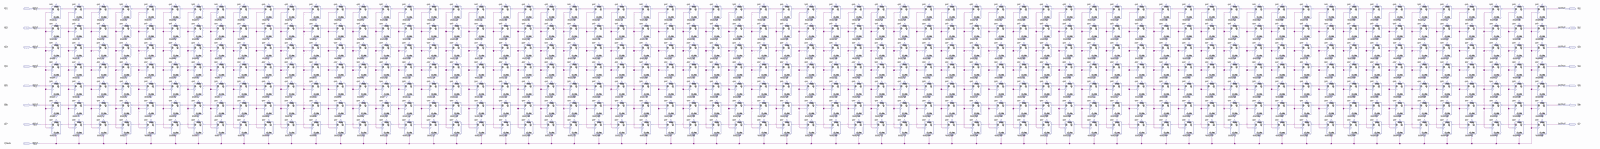
[diagram p0: schematic sheet, whole]
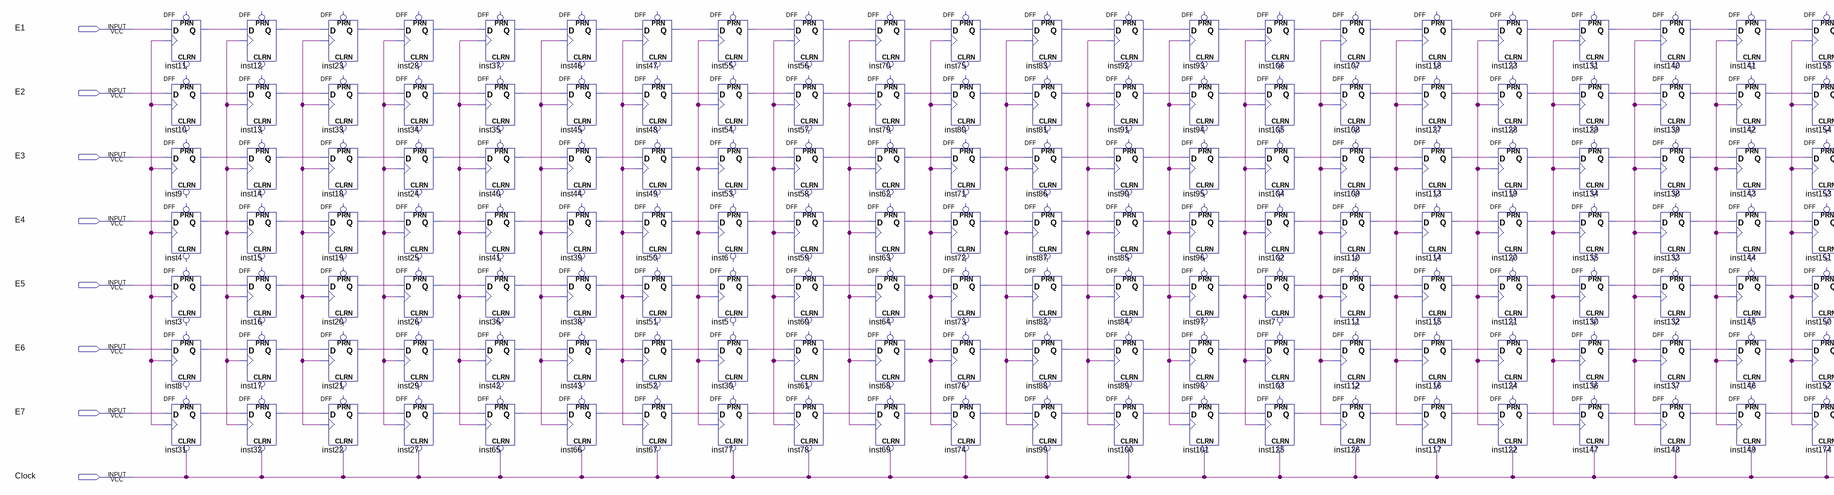
[diagram p1: schematic sheet, left part]
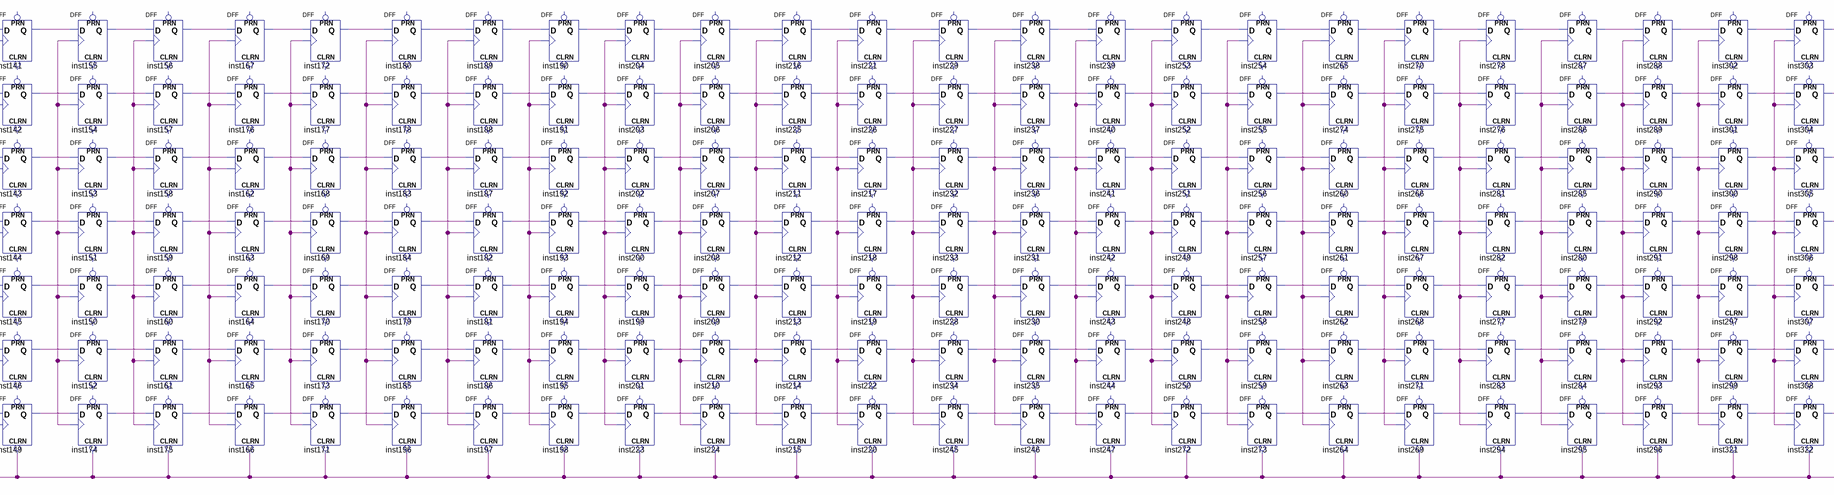
[diagram p2: schematic sheet, centre part]
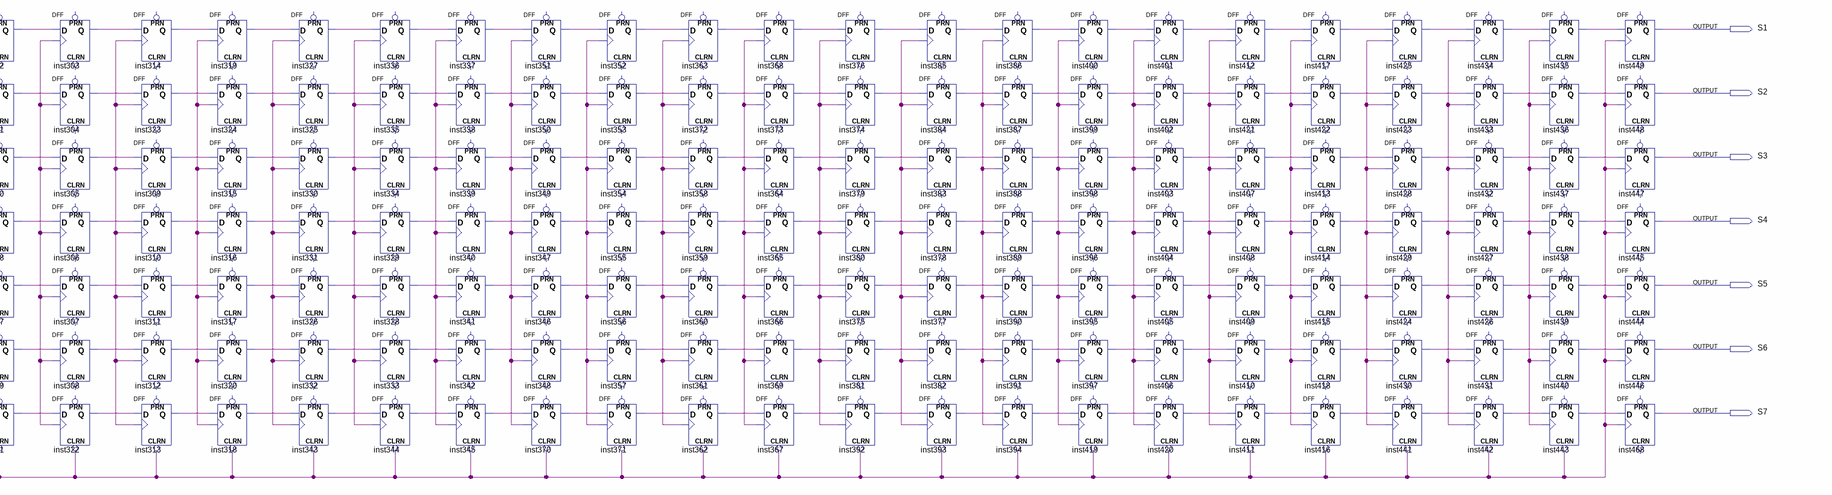
[diagram p3: schematic sheet, right part]
// Quartus schematic Memoria2.bdf as structural Verilog: 448 symbols, 15 pins
module Memoria2 (
  input  E1,
  input  E2,
  input  E3,
  input  E4,
  input  E5,
  input  E6,
  input  E7,
  input  Clock,
  output S1,
  output S2,
  output S3,
  output S4,
  output S5,
  output S6,
  output S7
);

  wire inst3_q, inst4_q, inst5_q, inst6_q, inst7_q, inst8_q, inst9_q, inst10_q, inst11_q, inst12_q, inst13_q,
       inst14_q, inst15_q, inst16_q, inst17_q, inst18_q, inst19_q, inst20_q, inst21_q, inst22_q, inst23_q,
       inst24_q, inst25_q, inst26_q, inst27_q, inst28_q, inst29_q, inst30_q, inst31_q, inst32_q, inst33_q,
       inst34_q, inst35_q, inst36_q, inst37_q, inst38_q, inst39_q, inst40_q, inst41_q, inst42_q, inst43_q,
       inst44_q, inst45_q, inst46_q, inst47_q, inst48_q, inst49_q, inst50_q, inst51_q, inst52_q, inst53_q,
       inst54_q, inst55_q, inst56_q, inst57_q, inst58_q, inst59_q, inst60_q, inst61_q, inst62_q, inst63_q,
       inst64_q, inst65_q, inst66_q, inst67_q, inst68_q, inst69_q, inst70_q, inst71_q, inst72_q, inst73_q,
       inst74_q, inst75_q, inst76_q, inst77_q, inst78_q, inst79_q, inst80_q, inst81_q, inst82_q, inst83_q,
       inst84_q, inst85_q, inst86_q, inst87_q, inst88_q, inst89_q, inst90_q, inst91_q, inst92_q, inst93_q,
       inst94_q, inst95_q, inst96_q, inst97_q, inst98_q, inst99_q, inst100_q, inst101_q, inst102_q,
       inst103_q, inst104_q, inst105_q, inst106_q, inst107_q, inst108_q, inst109_q, inst110_q, inst111_q,
       inst112_q, inst113_q, inst114_q, inst115_q, inst116_q, inst117_q, inst118_q, inst119_q, inst120_q,
       inst121_q, inst122_q, inst123_q, inst124_q, inst125_q, inst126_q, inst127_q, inst128_q, inst129_q,
       inst130_q, inst131_q, inst132_q, inst133_q, inst134_q, inst135_q, inst136_q, inst137_q, inst138_q,
       inst139_q, inst140_q, inst141_q, inst142_q, inst143_q, inst144_q, inst145_q, inst146_q, inst147_q,
       inst148_q, inst149_q, inst150_q, inst151_q, inst152_q, inst153_q, inst154_q, inst155_q, inst156_q,
       inst157_q, inst158_q, inst159_q, inst160_q, inst161_q, inst162_q, inst163_q, inst164_q, inst165_q,
       inst166_q, inst167_q, inst168_q, inst169_q, inst170_q, inst171_q, inst172_q, inst173_q, inst174_q,
       inst175_q, inst176_q, inst177_q, inst178_q, inst179_q, inst180_q, inst181_q, inst182_q, inst183_q,
       inst184_q, inst185_q, inst186_q, inst187_q, inst188_q, inst189_q, inst190_q, inst191_q, inst192_q,
       inst193_q, inst194_q, inst195_q, inst196_q, inst197_q, inst198_q, inst199_q, inst200_q, inst201_q,
       inst202_q, inst203_q, inst204_q, inst205_q, inst206_q, inst207_q, inst208_q, inst209_q, inst210_q,
       inst211_q, inst212_q, inst213_q, inst214_q, inst215_q, inst216_q, inst217_q, inst218_q, inst219_q,
       inst220_q, inst221_q, inst222_q, inst223_q, inst224_q, inst225_q, inst226_q, inst227_q, inst228_q,
       inst229_q, inst230_q, inst231_q, inst232_q, inst233_q, inst234_q, inst235_q, inst236_q, inst237_q,
       inst238_q, inst239_q, inst240_q, inst241_q, inst242_q, inst243_q, inst244_q, inst245_q, inst246_q,
       inst247_q, inst248_q, inst249_q, inst250_q, inst251_q, inst252_q, inst253_q, inst254_q, inst255_q,
       inst256_q, inst257_q, inst258_q, inst259_q, inst260_q, inst261_q, inst262_q, inst263_q, inst264_q,
       inst265_q, inst266_q, inst267_q, inst268_q, inst269_q, inst270_q, inst271_q, inst272_q, inst273_q,
       inst274_q, inst275_q, inst276_q, inst277_q, inst278_q, inst279_q, inst280_q, inst281_q, inst282_q,
       inst283_q, inst284_q, inst285_q, inst286_q, inst287_q, inst288_q, inst289_q, inst290_q, inst291_q,
       inst292_q, inst293_q, inst294_q, inst295_q, inst296_q, inst297_q, inst298_q, inst299_q, inst300_q,
       inst301_q, inst302_q, inst303_q, inst304_q, inst305_q, inst306_q, inst307_q, inst308_q, inst309_q,
       inst310_q, inst311_q, inst312_q, inst313_q, inst314_q, inst315_q, inst316_q, inst317_q, inst318_q,
       inst319_q, inst320_q, inst321_q, inst322_q, inst323_q, inst324_q, inst325_q, inst326_q, inst327_q,
       inst328_q, inst329_q, inst330_q, inst331_q, inst332_q, inst333_q, inst334_q, inst335_q, inst336_q,
       inst337_q, inst338_q, inst339_q, inst340_q, inst341_q, inst342_q, inst343_q, inst344_q, inst345_q,
       inst346_q, inst347_q, inst348_q, inst349_q, inst350_q, inst351_q, inst352_q, inst353_q, inst354_q,
       inst355_q, inst356_q, inst357_q, inst358_q, inst359_q, inst360_q, inst361_q, inst362_q, inst363_q,
       inst364_q, inst365_q, inst366_q, inst367_q, inst368_q, inst369_q, inst370_q, inst371_q, inst372_q,
       inst373_q, inst374_q, inst375_q, inst376_q, inst377_q, inst378_q, inst379_q, inst380_q, inst381_q,
       inst382_q, inst383_q, inst384_q, inst385_q, inst386_q, inst387_q, inst388_q, inst389_q, inst390_q,
       inst391_q, inst392_q, inst393_q, inst394_q, inst395_q, inst396_q, inst397_q, inst398_q, inst399_q,
       inst400_q, inst401_q, inst402_q, inst403_q, inst404_q, inst405_q, inst406_q, inst407_q, inst408_q,
       inst409_q, inst410_q, inst411_q, inst412_q, inst413_q, inst414_q, inst415_q, inst416_q, inst417_q,
       inst418_q, inst419_q, inst420_q, inst421_q, inst422_q, inst423_q, inst424_q, inst425_q, inst426_q,
       inst427_q, inst428_q, inst429_q, inst430_q, inst431_q, inst432_q, inst433_q, inst434_q, inst435_q,
       inst436_q, inst437_q, inst438_q, inst439_q, inst440_q, inst441_q, inst442_q, inst443_q, undriven,
       undriven_2, undriven_3, undriven_4, undriven_5, undriven_6, undriven_7, undriven_8, undriven_9,
       undriven_10, undriven_11, undriven_12, undriven_13, undriven_14, undriven_15, undriven_16,
       undriven_17, undriven_18, undriven_19, undriven_20, undriven_21, undriven_22, undriven_23,
       undriven_24, undriven_25, undriven_26, undriven_27, undriven_28, undriven_29, undriven_30,
       undriven_31, undriven_32, undriven_33, undriven_34, undriven_35, undriven_36, undriven_37,
       undriven_38, undriven_39, undriven_40, undriven_41, undriven_42, undriven_43, undriven_44,
       undriven_45, undriven_46, undriven_47, undriven_48, undriven_49, undriven_50, undriven_51,
       undriven_52, undriven_53, undriven_54, undriven_55, undriven_56, undriven_57, undriven_58,
       undriven_59, undriven_60, undriven_61, undriven_62, undriven_63;

  DFF inst11 (.CLK(undriven_2), .D(E1), .Q(inst11_q));  // open: CLRN, PRN
  DFF inst10 (.CLK(undriven_2), .D(E2), .Q(inst10_q));  // open: CLRN, PRN
  DFF inst9 (.CLK(undriven_2), .D(E3), .Q(inst9_q));  // open: CLRN, PRN
  DFF inst4 (.CLK(undriven_2), .D(E4), .Q(inst4_q));  // open: CLRN, PRN
  DFF inst3 (.CLK(undriven_2), .D(E5), .Q(inst3_q));  // open: CLRN, PRN
  DFF inst8 (.CLK(undriven_2), .D(E6), .Q(inst8_q));  // open: CLRN, PRN
  DFF inst31 (.CLRN(Clock), .CLK(undriven_2), .D(E7), .Q(inst31_q));  // open: PRN
  DFF inst12 (.CLK(undriven), .D(inst11_q), .Q(inst12_q));  // open: CLRN, PRN
  DFF inst13 (.CLK(undriven), .D(inst10_q), .Q(inst13_q));  // open: CLRN, PRN
  DFF inst14 (.CLK(undriven), .D(inst9_q), .Q(inst14_q));  // open: CLRN, PRN
  DFF inst15 (.CLK(undriven), .D(inst4_q), .Q(inst15_q));  // open: CLRN, PRN
  DFF inst16 (.CLK(undriven), .D(inst3_q), .Q(inst16_q));  // open: CLRN, PRN
  DFF inst17 (.CLK(undriven), .D(inst8_q), .Q(inst17_q));  // open: CLRN, PRN
  DFF inst32 (.CLRN(Clock), .CLK(undriven), .D(inst31_q), .Q(inst32_q));  // open: PRN
  DFF inst23 (.CLK(undriven_3), .D(inst12_q), .Q(inst23_q));  // open: CLRN, PRN
  DFF inst33 (.CLK(undriven_3), .D(inst13_q), .Q(inst33_q));  // open: CLRN, PRN
  DFF inst18 (.CLK(undriven_3), .D(inst14_q), .Q(inst18_q));  // open: CLRN, PRN
  DFF inst19 (.CLK(undriven_3), .D(inst15_q), .Q(inst19_q));  // open: CLRN, PRN
  DFF inst20 (.CLK(undriven_3), .D(inst16_q), .Q(inst20_q));  // open: CLRN, PRN
  DFF inst21 (.CLK(undriven_3), .D(inst17_q), .Q(inst21_q));  // open: CLRN, PRN
  DFF inst22 (.CLRN(Clock), .CLK(undriven_3), .D(inst32_q), .Q(inst22_q));  // open: PRN
  DFF inst28 (.CLK(undriven_4), .D(inst23_q), .Q(inst28_q));  // open: CLRN, PRN
  DFF inst34 (.CLK(undriven_4), .D(inst33_q), .Q(inst34_q));  // open: CLRN, PRN
  DFF inst24 (.CLK(undriven_4), .D(inst18_q), .Q(inst24_q));  // open: CLRN, PRN
  DFF inst25 (.CLK(undriven_4), .D(inst19_q), .Q(inst25_q));  // open: CLRN, PRN
  DFF inst26 (.CLK(undriven_4), .D(inst20_q), .Q(inst26_q));  // open: CLRN, PRN
  DFF inst29 (.CLK(undriven_4), .D(inst21_q), .Q(inst29_q));  // open: CLRN, PRN
  DFF inst27 (.CLRN(Clock), .CLK(undriven_4), .D(inst22_q), .Q(inst27_q));  // open: PRN
  DFF inst37 (.CLK(undriven_5), .D(inst28_q), .Q(inst37_q));  // open: CLRN, PRN
  DFF inst35 (.CLK(undriven_5), .D(inst34_q), .Q(inst35_q));  // open: CLRN, PRN
  DFF inst40 (.CLK(undriven_5), .D(inst24_q), .Q(inst40_q));  // open: CLRN, PRN
  DFF inst41 (.CLK(undriven_5), .D(inst25_q), .Q(inst41_q));  // open: CLRN, PRN
  DFF inst36 (.CLK(undriven_5), .D(inst26_q), .Q(inst36_q));  // open: CLRN, PRN
  DFF inst42 (.CLK(undriven_5), .D(inst29_q), .Q(inst42_q));  // open: CLRN, PRN
  DFF inst65 (.CLRN(Clock), .CLK(undriven_5), .D(inst27_q), .Q(inst65_q));  // open: PRN
  DFF inst46 (.CLK(undriven_6), .D(inst37_q), .Q(inst46_q));  // open: CLRN, PRN
  DFF inst45 (.CLK(undriven_6), .D(inst35_q), .Q(inst45_q));  // open: CLRN, PRN
  DFF inst44 (.CLK(undriven_6), .D(inst40_q), .Q(inst44_q));  // open: CLRN, PRN
  DFF inst39 (.CLK(undriven_6), .D(inst41_q), .Q(inst39_q));  // open: CLRN, PRN
  DFF inst38 (.CLK(undriven_6), .D(inst36_q), .Q(inst38_q));  // open: CLRN, PRN
  DFF inst43 (.CLK(undriven_6), .D(inst42_q), .Q(inst43_q));  // open: CLRN, PRN
  DFF inst66 (.CLRN(Clock), .CLK(undriven_6), .D(inst65_q), .Q(inst66_q));  // open: PRN
  DFF inst47 (.CLK(undriven_7), .D(inst46_q), .Q(inst47_q));  // open: CLRN, PRN
  DFF inst48 (.CLK(undriven_7), .D(inst45_q), .Q(inst48_q));  // open: CLRN, PRN
  DFF inst49 (.CLK(undriven_7), .D(inst44_q), .Q(inst49_q));  // open: CLRN, PRN
  DFF inst50 (.CLK(undriven_7), .D(inst39_q), .Q(inst50_q));  // open: CLRN, PRN
  DFF inst51 (.CLK(undriven_7), .D(inst38_q), .Q(inst51_q));  // open: CLRN, PRN
  DFF inst52 (.CLK(undriven_7), .D(inst43_q), .Q(inst52_q));  // open: CLRN, PRN
  DFF inst67 (.CLRN(Clock), .CLK(undriven_7), .D(inst66_q), .Q(inst67_q));  // open: PRN
  DFF inst55 (.CLK(undriven_9), .D(inst47_q), .Q(inst55_q));  // open: CLRN, PRN
  DFF inst54 (.CLK(undriven_9), .D(inst48_q), .Q(inst54_q));  // open: CLRN, PRN
  DFF inst53 (.CLK(undriven_9), .D(inst49_q), .Q(inst53_q));  // open: CLRN, PRN
  DFF inst6 (.CLK(undriven_9), .D(inst50_q), .Q(inst6_q));  // open: CLRN, PRN
  DFF inst5 (.CLK(undriven_9), .D(inst51_q), .Q(inst5_q));  // open: CLRN, PRN
  DFF inst30 (.CLK(undriven_9), .D(inst52_q), .Q(inst30_q));  // open: CLRN, PRN
  DFF inst77 (.CLRN(Clock), .CLK(undriven_9), .D(inst67_q), .Q(inst77_q));  // open: PRN
  DFF inst56 (.CLK(undriven_8), .D(inst55_q), .Q(inst56_q));  // open: CLRN, PRN
  DFF inst57 (.CLK(undriven_8), .D(inst54_q), .Q(inst57_q));  // open: CLRN, PRN
  DFF inst58 (.CLK(undriven_8), .D(inst53_q), .Q(inst58_q));  // open: CLRN, PRN
  DFF inst59 (.CLK(undriven_8), .D(inst6_q), .Q(inst59_q));  // open: CLRN, PRN
  DFF inst60 (.CLK(undriven_8), .D(inst5_q), .Q(inst60_q));  // open: CLRN, PRN
  DFF inst61 (.CLK(undriven_8), .D(inst30_q), .Q(inst61_q));  // open: CLRN, PRN
  DFF inst78 (.CLRN(Clock), .CLK(undriven_8), .D(inst77_q), .Q(inst78_q));  // open: PRN
  DFF inst70 (.CLK(undriven_10), .D(inst56_q), .Q(inst70_q));  // open: CLRN, PRN
  DFF inst79 (.CLK(undriven_10), .D(inst57_q), .Q(inst79_q));  // open: CLRN, PRN
  DFF inst62 (.CLK(undriven_10), .D(inst58_q), .Q(inst62_q));  // open: CLRN, PRN
  DFF inst63 (.CLK(undriven_10), .D(inst59_q), .Q(inst63_q));  // open: CLRN, PRN
  DFF inst64 (.CLK(undriven_10), .D(inst60_q), .Q(inst64_q));  // open: CLRN, PRN
  DFF inst68 (.CLK(undriven_10), .D(inst61_q), .Q(inst68_q));  // open: CLRN, PRN
  DFF inst69 (.CLRN(Clock), .CLK(undriven_10), .D(inst78_q), .Q(inst69_q));  // open: PRN
  DFF inst75 (.CLK(undriven_11), .D(inst70_q), .Q(inst75_q));  // open: CLRN, PRN
  DFF inst80 (.CLK(undriven_11), .D(inst79_q), .Q(inst80_q));  // open: CLRN, PRN
  DFF inst71 (.CLK(undriven_11), .D(inst62_q), .Q(inst71_q));  // open: CLRN, PRN
  DFF inst72 (.CLK(undriven_11), .D(inst63_q), .Q(inst72_q));  // open: CLRN, PRN
  DFF inst73 (.CLK(undriven_11), .D(inst64_q), .Q(inst73_q));  // open: CLRN, PRN
  DFF inst76 (.CLK(undriven_11), .D(inst68_q), .Q(inst76_q));  // open: CLRN, PRN
  DFF inst74 (.CLRN(Clock), .CLK(undriven_11), .D(inst69_q), .Q(inst74_q));  // open: PRN
  DFF inst83 (.CLK(undriven_12), .D(inst75_q), .Q(inst83_q));  // open: CLRN, PRN
  DFF inst81 (.CLK(undriven_12), .D(inst80_q), .Q(inst81_q));  // open: CLRN, PRN
  DFF inst86 (.CLK(undriven_12), .D(inst71_q), .Q(inst86_q));  // open: CLRN, PRN
  DFF inst87 (.CLK(undriven_12), .D(inst72_q), .Q(inst87_q));  // open: CLRN, PRN
  DFF inst82 (.CLK(undriven_12), .D(inst73_q), .Q(inst82_q));  // open: CLRN, PRN
  DFF inst88 (.CLK(undriven_12), .D(inst76_q), .Q(inst88_q));  // open: CLRN, PRN
  DFF inst99 (.CLRN(Clock), .CLK(undriven_12), .D(inst74_q), .Q(inst99_q));  // open: PRN
  DFF inst92 (.CLK(undriven_13), .D(inst83_q), .Q(inst92_q));  // open: CLRN, PRN
  DFF inst91 (.CLK(undriven_13), .D(inst81_q), .Q(inst91_q));  // open: CLRN, PRN
  DFF inst90 (.CLK(undriven_13), .D(inst86_q), .Q(inst90_q));  // open: CLRN, PRN
  DFF inst85 (.CLK(undriven_13), .D(inst87_q), .Q(inst85_q));  // open: CLRN, PRN
  DFF inst84 (.CLK(undriven_13), .D(inst82_q), .Q(inst84_q));  // open: CLRN, PRN
  DFF inst89 (.CLK(undriven_13), .D(inst88_q), .Q(inst89_q));  // open: CLRN, PRN
  DFF inst100 (.CLRN(Clock), .CLK(undriven_13), .D(inst99_q), .Q(inst100_q));  // open: PRN
  DFF inst93 (.CLK(undriven_14), .D(inst92_q), .Q(inst93_q));  // open: CLRN, PRN
  DFF inst94 (.CLK(undriven_14), .D(inst91_q), .Q(inst94_q));  // open: CLRN, PRN
  DFF inst95 (.CLK(undriven_14), .D(inst90_q), .Q(inst95_q));  // open: CLRN, PRN
  DFF inst96 (.CLK(undriven_14), .D(inst85_q), .Q(inst96_q));  // open: CLRN, PRN
  DFF inst97 (.CLK(undriven_14), .D(inst84_q), .Q(inst97_q));  // open: CLRN, PRN
  DFF inst98 (.CLK(undriven_14), .D(inst89_q), .Q(inst98_q));  // open: CLRN, PRN
  DFF inst101 (.CLRN(Clock), .CLK(undriven_14), .D(inst100_q), .Q(inst101_q));  // open: PRN
  DFF inst106 (.CLK(undriven_16), .D(inst93_q), .Q(inst106_q));  // open: CLRN, PRN
  DFF inst105 (.CLK(undriven_16), .D(inst94_q), .Q(inst105_q));  // open: CLRN, PRN
  DFF inst104 (.CLK(undriven_16), .D(inst95_q), .Q(inst104_q));  // open: CLRN, PRN
  DFF inst102 (.CLK(undriven_16), .D(inst96_q), .Q(inst102_q));  // open: CLRN, PRN
  DFF inst7 (.CLK(undriven_16), .D(inst97_q), .Q(inst7_q));  // open: CLRN, PRN
  DFF inst103 (.CLK(undriven_16), .D(inst98_q), .Q(inst103_q));  // open: CLRN, PRN
  DFF inst125 (.CLRN(Clock), .CLK(undriven_16), .D(inst101_q), .Q(inst125_q));  // open: PRN
  DFF inst107 (.CLK(undriven_15), .D(inst106_q), .Q(inst107_q));  // open: CLRN, PRN
  DFF inst108 (.CLK(undriven_15), .D(inst105_q), .Q(inst108_q));  // open: CLRN, PRN
  DFF inst109 (.CLK(undriven_15), .D(inst104_q), .Q(inst109_q));  // open: CLRN, PRN
  DFF inst110 (.CLK(undriven_15), .D(inst102_q), .Q(inst110_q));  // open: CLRN, PRN
  DFF inst111 (.CLK(undriven_15), .D(inst7_q), .Q(inst111_q));  // open: CLRN, PRN
  DFF inst112 (.CLK(undriven_15), .D(inst103_q), .Q(inst112_q));  // open: CLRN, PRN
  DFF inst126 (.CLRN(Clock), .CLK(undriven_15), .D(inst125_q), .Q(inst126_q));  // open: PRN
  DFF inst118 (.CLK(undriven_17), .D(inst107_q), .Q(inst118_q));  // open: CLRN, PRN
  DFF inst127 (.CLK(undriven_17), .D(inst108_q), .Q(inst127_q));  // open: CLRN, PRN
  DFF inst113 (.CLK(undriven_17), .D(inst109_q), .Q(inst113_q));  // open: CLRN, PRN
  DFF inst114 (.CLK(undriven_17), .D(inst110_q), .Q(inst114_q));  // open: CLRN, PRN
  DFF inst115 (.CLK(undriven_17), .D(inst111_q), .Q(inst115_q));  // open: CLRN, PRN
  DFF inst116 (.CLK(undriven_17), .D(inst112_q), .Q(inst116_q));  // open: CLRN, PRN
  DFF inst117 (.CLRN(Clock), .CLK(undriven_17), .D(inst126_q), .Q(inst117_q));  // open: PRN
  DFF inst123 (.CLK(undriven_18), .D(inst118_q), .Q(inst123_q));  // open: CLRN, PRN
  DFF inst128 (.CLK(undriven_18), .D(inst127_q), .Q(inst128_q));  // open: CLRN, PRN
  DFF inst119 (.CLK(undriven_18), .D(inst113_q), .Q(inst119_q));  // open: CLRN, PRN
  DFF inst120 (.CLK(undriven_18), .D(inst114_q), .Q(inst120_q));  // open: CLRN, PRN
  DFF inst121 (.CLK(undriven_18), .D(inst115_q), .Q(inst121_q));  // open: CLRN, PRN
  DFF inst124 (.CLK(undriven_18), .D(inst116_q), .Q(inst124_q));  // open: CLRN, PRN
  DFF inst122 (.CLRN(Clock), .CLK(undriven_18), .D(inst117_q), .Q(inst122_q));  // open: PRN
  DFF inst131 (.CLK(undriven_19), .D(inst123_q), .Q(inst131_q));  // open: CLRN, PRN
  DFF inst129 (.CLK(undriven_19), .D(inst128_q), .Q(inst129_q));  // open: CLRN, PRN
  DFF inst134 (.CLK(undriven_19), .D(inst119_q), .Q(inst134_q));  // open: CLRN, PRN
  DFF inst135 (.CLK(undriven_19), .D(inst120_q), .Q(inst135_q));  // open: CLRN, PRN
  DFF inst130 (.CLK(undriven_19), .D(inst121_q), .Q(inst130_q));  // open: CLRN, PRN
  DFF inst136 (.CLK(undriven_19), .D(inst124_q), .Q(inst136_q));  // open: CLRN, PRN
  DFF inst147 (.CLRN(Clock), .CLK(undriven_19), .D(inst122_q), .Q(inst147_q));  // open: PRN
  DFF inst140 (.CLK(undriven_20), .D(inst131_q), .Q(inst140_q));  // open: CLRN, PRN
  DFF inst139 (.CLK(undriven_20), .D(inst129_q), .Q(inst139_q));  // open: CLRN, PRN
  DFF inst138 (.CLK(undriven_20), .D(inst134_q), .Q(inst138_q));  // open: CLRN, PRN
  DFF inst133 (.CLK(undriven_20), .D(inst135_q), .Q(inst133_q));  // open: CLRN, PRN
  DFF inst132 (.CLK(undriven_20), .D(inst130_q), .Q(inst132_q));  // open: CLRN, PRN
  DFF inst137 (.CLK(undriven_20), .D(inst136_q), .Q(inst137_q));  // open: CLRN, PRN
  DFF inst148 (.CLRN(Clock), .CLK(undriven_20), .D(inst147_q), .Q(inst148_q));  // open: PRN
  DFF inst141 (.CLK(undriven_21), .D(inst140_q), .Q(inst141_q));  // open: CLRN, PRN
  DFF inst142 (.CLK(undriven_21), .D(inst139_q), .Q(inst142_q));  // open: CLRN, PRN
  DFF inst143 (.CLK(undriven_21), .D(inst138_q), .Q(inst143_q));  // open: CLRN, PRN
  DFF inst144 (.CLK(undriven_21), .D(inst133_q), .Q(inst144_q));  // open: CLRN, PRN
  DFF inst145 (.CLK(undriven_21), .D(inst132_q), .Q(inst145_q));  // open: CLRN, PRN
  DFF inst146 (.CLK(undriven_21), .D(inst137_q), .Q(inst146_q));  // open: CLRN, PRN
  DFF inst149 (.CLRN(Clock), .CLK(undriven_21), .D(inst148_q), .Q(inst149_q));  // open: PRN
  DFF inst155 (.CLK(undriven_23), .D(inst141_q), .Q(inst155_q));  // open: CLRN, PRN
  DFF inst154 (.CLK(undriven_23), .D(inst142_q), .Q(inst154_q));  // open: CLRN, PRN
  DFF inst153 (.CLK(undriven_23), .D(inst143_q), .Q(inst153_q));  // open: CLRN, PRN
  DFF inst151 (.CLK(undriven_23), .D(inst144_q), .Q(inst151_q));  // open: CLRN, PRN
  DFF inst150 (.CLK(undriven_23), .D(inst145_q), .Q(inst150_q));  // open: CLRN, PRN
  DFF inst152 (.CLK(undriven_23), .D(inst146_q), .Q(inst152_q));  // open: CLRN, PRN
  DFF inst174 (.CLRN(Clock), .CLK(undriven_23), .D(inst149_q), .Q(inst174_q));  // open: PRN
  DFF inst156 (.CLK(undriven_22), .D(inst155_q), .Q(inst156_q));  // open: CLRN, PRN
  DFF inst157 (.CLK(undriven_22), .D(inst154_q), .Q(inst157_q));  // open: CLRN, PRN
  DFF inst158 (.CLK(undriven_22), .D(inst153_q), .Q(inst158_q));  // open: CLRN, PRN
  DFF inst159 (.CLK(undriven_22), .D(inst151_q), .Q(inst159_q));  // open: CLRN, PRN
  DFF inst160 (.CLK(undriven_22), .D(inst150_q), .Q(inst160_q));  // open: CLRN, PRN
  DFF inst161 (.CLK(undriven_22), .D(inst152_q), .Q(inst161_q));  // open: CLRN, PRN
  DFF inst175 (.CLRN(Clock), .CLK(undriven_22), .D(inst174_q), .Q(inst175_q));  // open: PRN
  DFF inst167 (.CLK(undriven_24), .D(inst156_q), .Q(inst167_q));  // open: CLRN, PRN
  DFF inst176 (.CLK(undriven_24), .D(inst157_q), .Q(inst176_q));  // open: CLRN, PRN
  DFF inst162 (.CLK(undriven_24), .D(inst158_q), .Q(inst162_q));  // open: CLRN, PRN
  DFF inst163 (.CLK(undriven_24), .D(inst159_q), .Q(inst163_q));  // open: CLRN, PRN
  DFF inst164 (.CLK(undriven_24), .D(inst160_q), .Q(inst164_q));  // open: CLRN, PRN
  DFF inst165 (.CLK(undriven_24), .D(inst161_q), .Q(inst165_q));  // open: CLRN, PRN
  DFF inst166 (.CLRN(Clock), .CLK(undriven_24), .D(inst175_q), .Q(inst166_q));  // open: PRN
  DFF inst172 (.CLK(undriven_25), .D(inst167_q), .Q(inst172_q));  // open: CLRN, PRN
  DFF inst177 (.CLK(undriven_25), .D(inst176_q), .Q(inst177_q));  // open: CLRN, PRN
  DFF inst168 (.CLK(undriven_25), .D(inst162_q), .Q(inst168_q));  // open: CLRN, PRN
  DFF inst169 (.CLK(undriven_25), .D(inst163_q), .Q(inst169_q));  // open: CLRN, PRN
  DFF inst170 (.CLK(undriven_25), .D(inst164_q), .Q(inst170_q));  // open: CLRN, PRN
  DFF inst173 (.CLK(undriven_25), .D(inst165_q), .Q(inst173_q));  // open: CLRN, PRN
  DFF inst171 (.CLRN(Clock), .CLK(undriven_25), .D(inst166_q), .Q(inst171_q));  // open: PRN
  DFF inst180 (.CLK(undriven_26), .D(inst172_q), .Q(inst180_q));  // open: CLRN, PRN
  DFF inst178 (.CLK(undriven_26), .D(inst177_q), .Q(inst178_q));  // open: CLRN, PRN
  DFF inst183 (.CLK(undriven_26), .D(inst168_q), .Q(inst183_q));  // open: CLRN, PRN
  DFF inst184 (.CLK(undriven_26), .D(inst169_q), .Q(inst184_q));  // open: CLRN, PRN
  DFF inst179 (.CLK(undriven_26), .D(inst170_q), .Q(inst179_q));  // open: CLRN, PRN
  DFF inst185 (.CLK(undriven_26), .D(inst173_q), .Q(inst185_q));  // open: CLRN, PRN
  DFF inst196 (.CLRN(Clock), .CLK(undriven_26), .D(inst171_q), .Q(inst196_q));  // open: PRN
  DFF inst189 (.CLK(undriven_27), .D(inst180_q), .Q(inst189_q));  // open: CLRN, PRN
  DFF inst188 (.CLK(undriven_27), .D(inst178_q), .Q(inst188_q));  // open: CLRN, PRN
  DFF inst187 (.CLK(undriven_27), .D(inst183_q), .Q(inst187_q));  // open: CLRN, PRN
  DFF inst182 (.CLK(undriven_27), .D(inst184_q), .Q(inst182_q));  // open: CLRN, PRN
  DFF inst181 (.CLK(undriven_27), .D(inst179_q), .Q(inst181_q));  // open: CLRN, PRN
  DFF inst186 (.CLK(undriven_27), .D(inst185_q), .Q(inst186_q));  // open: CLRN, PRN
  DFF inst197 (.CLRN(Clock), .CLK(undriven_27), .D(inst196_q), .Q(inst197_q));  // open: PRN
  DFF inst190 (.CLK(undriven_28), .D(inst189_q), .Q(inst190_q));  // open: CLRN, PRN
  DFF inst191 (.CLK(undriven_28), .D(inst188_q), .Q(inst191_q));  // open: CLRN, PRN
  DFF inst192 (.CLK(undriven_28), .D(inst187_q), .Q(inst192_q));  // open: CLRN, PRN
  DFF inst193 (.CLK(undriven_28), .D(inst182_q), .Q(inst193_q));  // open: CLRN, PRN
  DFF inst194 (.CLK(undriven_28), .D(inst181_q), .Q(inst194_q));  // open: CLRN, PRN
  DFF inst195 (.CLK(undriven_28), .D(inst186_q), .Q(inst195_q));  // open: CLRN, PRN
  DFF inst198 (.CLRN(Clock), .CLK(undriven_28), .D(inst197_q), .Q(inst198_q));  // open: PRN
  DFF inst204 (.CLK(undriven_30), .D(inst190_q), .Q(inst204_q));  // open: CLRN, PRN
  DFF inst203 (.CLK(undriven_30), .D(inst191_q), .Q(inst203_q));  // open: CLRN, PRN
  DFF inst202 (.CLK(undriven_30), .D(inst192_q), .Q(inst202_q));  // open: CLRN, PRN
  DFF inst200 (.CLK(undriven_30), .D(inst193_q), .Q(inst200_q));  // open: CLRN, PRN
  DFF inst199 (.CLK(undriven_30), .D(inst194_q), .Q(inst199_q));  // open: CLRN, PRN
  DFF inst201 (.CLK(undriven_30), .D(inst195_q), .Q(inst201_q));  // open: CLRN, PRN
  DFF inst223 (.CLRN(Clock), .CLK(undriven_30), .D(inst198_q), .Q(inst223_q));  // open: PRN
  DFF inst205 (.CLK(undriven_29), .D(inst204_q), .Q(inst205_q));  // open: CLRN, PRN
  DFF inst206 (.CLK(undriven_29), .D(inst203_q), .Q(inst206_q));  // open: CLRN, PRN
  DFF inst207 (.CLK(undriven_29), .D(inst202_q), .Q(inst207_q));  // open: CLRN, PRN
  DFF inst208 (.CLK(undriven_29), .D(inst200_q), .Q(inst208_q));  // open: CLRN, PRN
  DFF inst209 (.CLK(undriven_29), .D(inst199_q), .Q(inst209_q));  // open: CLRN, PRN
  DFF inst210 (.CLK(undriven_29), .D(inst201_q), .Q(inst210_q));  // open: CLRN, PRN
  DFF inst224 (.CLRN(Clock), .CLK(undriven_29), .D(inst223_q), .Q(inst224_q));  // open: PRN
  DFF inst216 (.CLK(undriven_31), .D(inst205_q), .Q(inst216_q));  // open: CLRN, PRN
  DFF inst225 (.CLK(undriven_31), .D(inst206_q), .Q(inst225_q));  // open: CLRN, PRN
  DFF inst211 (.CLK(undriven_31), .D(inst207_q), .Q(inst211_q));  // open: CLRN, PRN
  DFF inst212 (.CLK(undriven_31), .D(inst208_q), .Q(inst212_q));  // open: CLRN, PRN
  DFF inst213 (.CLK(undriven_31), .D(inst209_q), .Q(inst213_q));  // open: CLRN, PRN
  DFF inst214 (.CLK(undriven_31), .D(inst210_q), .Q(inst214_q));  // open: CLRN, PRN
  DFF inst215 (.CLRN(Clock), .CLK(undriven_31), .D(inst224_q), .Q(inst215_q));  // open: PRN
  DFF inst221 (.CLK(undriven_32), .D(inst216_q), .Q(inst221_q));  // open: CLRN, PRN
  DFF inst226 (.CLK(undriven_32), .D(inst225_q), .Q(inst226_q));  // open: CLRN, PRN
  DFF inst217 (.CLK(undriven_32), .D(inst211_q), .Q(inst217_q));  // open: CLRN, PRN
  DFF inst218 (.CLK(undriven_32), .D(inst212_q), .Q(inst218_q));  // open: CLRN, PRN
  DFF inst219 (.CLK(undriven_32), .D(inst213_q), .Q(inst219_q));  // open: CLRN, PRN
  DFF inst222 (.CLK(undriven_32), .D(inst214_q), .Q(inst222_q));  // open: CLRN, PRN
  DFF inst220 (.CLRN(Clock), .CLK(undriven_32), .D(inst215_q), .Q(inst220_q));  // open: PRN
  DFF inst229 (.CLK(undriven_33), .D(inst221_q), .Q(inst229_q));  // open: CLRN, PRN
  DFF inst227 (.CLK(undriven_33), .D(inst226_q), .Q(inst227_q));  // open: CLRN, PRN
  DFF inst232 (.CLK(undriven_33), .D(inst217_q), .Q(inst232_q));  // open: CLRN, PRN
  DFF inst233 (.CLK(undriven_33), .D(inst218_q), .Q(inst233_q));  // open: CLRN, PRN
  DFF inst228 (.CLK(undriven_33), .D(inst219_q), .Q(inst228_q));  // open: CLRN, PRN
  DFF inst234 (.CLK(undriven_33), .D(inst222_q), .Q(inst234_q));  // open: CLRN, PRN
  DFF inst245 (.CLRN(Clock), .CLK(undriven_33), .D(inst220_q), .Q(inst245_q));  // open: PRN
  DFF inst238 (.CLK(undriven_34), .D(inst229_q), .Q(inst238_q));  // open: CLRN, PRN
  DFF inst237 (.CLK(undriven_34), .D(inst227_q), .Q(inst237_q));  // open: CLRN, PRN
  DFF inst236 (.CLK(undriven_34), .D(inst232_q), .Q(inst236_q));  // open: CLRN, PRN
  DFF inst231 (.CLK(undriven_34), .D(inst233_q), .Q(inst231_q));  // open: CLRN, PRN
  DFF inst230 (.CLK(undriven_34), .D(inst228_q), .Q(inst230_q));  // open: CLRN, PRN
  DFF inst235 (.CLK(undriven_34), .D(inst234_q), .Q(inst235_q));  // open: CLRN, PRN
  DFF inst246 (.CLRN(Clock), .CLK(undriven_34), .D(inst245_q), .Q(inst246_q));  // open: PRN
  DFF inst239 (.CLK(undriven_35), .D(inst238_q), .Q(inst239_q));  // open: CLRN, PRN
  DFF inst240 (.CLK(undriven_35), .D(inst237_q), .Q(inst240_q));  // open: CLRN, PRN
  DFF inst241 (.CLK(undriven_35), .D(inst236_q), .Q(inst241_q));  // open: CLRN, PRN
  DFF inst242 (.CLK(undriven_35), .D(inst231_q), .Q(inst242_q));  // open: CLRN, PRN
  DFF inst243 (.CLK(undriven_35), .D(inst230_q), .Q(inst243_q));  // open: CLRN, PRN
  DFF inst244 (.CLK(undriven_35), .D(inst235_q), .Q(inst244_q));  // open: CLRN, PRN
  DFF inst247 (.CLRN(Clock), .CLK(undriven_35), .D(inst246_q), .Q(inst247_q));  // open: PRN
  DFF inst253 (.CLK(undriven_37), .D(inst239_q), .Q(inst253_q));  // open: CLRN, PRN
  DFF inst252 (.CLK(undriven_37), .D(inst240_q), .Q(inst252_q));  // open: CLRN, PRN
  DFF inst251 (.CLK(undriven_37), .D(inst241_q), .Q(inst251_q));  // open: CLRN, PRN
  DFF inst249 (.CLK(undriven_37), .D(inst242_q), .Q(inst249_q));  // open: CLRN, PRN
  DFF inst248 (.CLK(undriven_37), .D(inst243_q), .Q(inst248_q));  // open: CLRN, PRN
  DFF inst250 (.CLK(undriven_37), .D(inst244_q), .Q(inst250_q));  // open: CLRN, PRN
  DFF inst272 (.CLRN(Clock), .CLK(undriven_37), .D(inst247_q), .Q(inst272_q));  // open: PRN
  DFF inst254 (.CLK(undriven_36), .D(inst253_q), .Q(inst254_q));  // open: CLRN, PRN
  DFF inst255 (.CLK(undriven_36), .D(inst252_q), .Q(inst255_q));  // open: CLRN, PRN
  DFF inst256 (.CLK(undriven_36), .D(inst251_q), .Q(inst256_q));  // open: CLRN, PRN
  DFF inst257 (.CLK(undriven_36), .D(inst249_q), .Q(inst257_q));  // open: CLRN, PRN
  DFF inst258 (.CLK(undriven_36), .D(inst248_q), .Q(inst258_q));  // open: CLRN, PRN
  DFF inst259 (.CLK(undriven_36), .D(inst250_q), .Q(inst259_q));  // open: CLRN, PRN
  DFF inst273 (.CLRN(Clock), .CLK(undriven_36), .D(inst272_q), .Q(inst273_q));  // open: PRN
  DFF inst265 (.CLK(undriven_38), .D(inst254_q), .Q(inst265_q));  // open: CLRN, PRN
  DFF inst274 (.CLK(undriven_38), .D(inst255_q), .Q(inst274_q));  // open: CLRN, PRN
  DFF inst260 (.CLK(undriven_38), .D(inst256_q), .Q(inst260_q));  // open: CLRN, PRN
  DFF inst261 (.CLK(undriven_38), .D(inst257_q), .Q(inst261_q));  // open: CLRN, PRN
  DFF inst262 (.CLK(undriven_38), .D(inst258_q), .Q(inst262_q));  // open: CLRN, PRN
  DFF inst263 (.CLK(undriven_38), .D(inst259_q), .Q(inst263_q));  // open: CLRN, PRN
  DFF inst264 (.CLRN(Clock), .CLK(undriven_38), .D(inst273_q), .Q(inst264_q));  // open: PRN
  DFF inst270 (.CLK(undriven_39), .D(inst265_q), .Q(inst270_q));  // open: CLRN, PRN
  DFF inst275 (.CLK(undriven_39), .D(inst274_q), .Q(inst275_q));  // open: CLRN, PRN
  DFF inst266 (.CLK(undriven_39), .D(inst260_q), .Q(inst266_q));  // open: CLRN, PRN
  DFF inst267 (.CLK(undriven_39), .D(inst261_q), .Q(inst267_q));  // open: CLRN, PRN
  DFF inst268 (.CLK(undriven_39), .D(inst262_q), .Q(inst268_q));  // open: CLRN, PRN
  DFF inst271 (.CLK(undriven_39), .D(inst263_q), .Q(inst271_q));  // open: CLRN, PRN
  DFF inst269 (.CLRN(Clock), .CLK(undriven_39), .D(inst264_q), .Q(inst269_q));  // open: PRN
  DFF inst278 (.CLK(undriven_40), .D(inst270_q), .Q(inst278_q));  // open: CLRN, PRN
  DFF inst276 (.CLK(undriven_40), .D(inst275_q), .Q(inst276_q));  // open: CLRN, PRN
  DFF inst281 (.CLK(undriven_40), .D(inst266_q), .Q(inst281_q));  // open: CLRN, PRN
  DFF inst282 (.CLK(undriven_40), .D(inst267_q), .Q(inst282_q));  // open: CLRN, PRN
  DFF inst277 (.CLK(undriven_40), .D(inst268_q), .Q(inst277_q));  // open: CLRN, PRN
  DFF inst283 (.CLK(undriven_40), .D(inst271_q), .Q(inst283_q));  // open: CLRN, PRN
  DFF inst294 (.CLRN(Clock), .CLK(undriven_40), .D(inst269_q), .Q(inst294_q));  // open: PRN
  DFF inst287 (.CLK(undriven_41), .D(inst278_q), .Q(inst287_q));  // open: CLRN, PRN
  DFF inst286 (.CLK(undriven_41), .D(inst276_q), .Q(inst286_q));  // open: CLRN, PRN
  DFF inst285 (.CLK(undriven_41), .D(inst281_q), .Q(inst285_q));  // open: CLRN, PRN
  DFF inst280 (.CLK(undriven_41), .D(inst282_q), .Q(inst280_q));  // open: CLRN, PRN
  DFF inst279 (.CLK(undriven_41), .D(inst277_q), .Q(inst279_q));  // open: CLRN, PRN
  DFF inst284 (.CLK(undriven_41), .D(inst283_q), .Q(inst284_q));  // open: CLRN, PRN
  DFF inst295 (.CLRN(Clock), .CLK(undriven_41), .D(inst294_q), .Q(inst295_q));  // open: PRN
  DFF inst288 (.CLK(undriven_42), .D(inst287_q), .Q(inst288_q));  // open: CLRN, PRN
  DFF inst289 (.CLK(undriven_42), .D(inst286_q), .Q(inst289_q));  // open: CLRN, PRN
  DFF inst290 (.CLK(undriven_42), .D(inst285_q), .Q(inst290_q));  // open: CLRN, PRN
  DFF inst291 (.CLK(undriven_42), .D(inst280_q), .Q(inst291_q));  // open: CLRN, PRN
  DFF inst292 (.CLK(undriven_42), .D(inst279_q), .Q(inst292_q));  // open: CLRN, PRN
  DFF inst293 (.CLK(undriven_42), .D(inst284_q), .Q(inst293_q));  // open: CLRN, PRN
  DFF inst296 (.CLRN(Clock), .CLK(undriven_42), .D(inst295_q), .Q(inst296_q));  // open: PRN
  DFF inst302 (.CLK(undriven_44), .D(inst288_q), .Q(inst302_q));  // open: CLRN, PRN
  DFF inst301 (.CLK(undriven_44), .D(inst289_q), .Q(inst301_q));  // open: CLRN, PRN
  DFF inst300 (.CLK(undriven_44), .D(inst290_q), .Q(inst300_q));  // open: CLRN, PRN
  DFF inst298 (.CLK(undriven_44), .D(inst291_q), .Q(inst298_q));  // open: CLRN, PRN
  DFF inst297 (.CLK(undriven_44), .D(inst292_q), .Q(inst297_q));  // open: CLRN, PRN
  DFF inst299 (.CLK(undriven_44), .D(inst293_q), .Q(inst299_q));  // open: CLRN, PRN
  DFF inst321 (.CLRN(Clock), .CLK(undriven_44), .D(inst296_q), .Q(inst321_q));  // open: PRN
  DFF inst303 (.CLK(undriven_43), .D(inst302_q), .Q(inst303_q));  // open: CLRN, PRN
  DFF inst304 (.CLK(undriven_43), .D(inst301_q), .Q(inst304_q));  // open: CLRN, PRN
  DFF inst305 (.CLK(undriven_43), .D(inst300_q), .Q(inst305_q));  // open: CLRN, PRN
  DFF inst306 (.CLK(undriven_43), .D(inst298_q), .Q(inst306_q));  // open: CLRN, PRN
  DFF inst307 (.CLK(undriven_43), .D(inst297_q), .Q(inst307_q));  // open: CLRN, PRN
  DFF inst308 (.CLK(undriven_43), .D(inst299_q), .Q(inst308_q));  // open: CLRN, PRN
  DFF inst322 (.CLRN(Clock), .CLK(undriven_43), .D(inst321_q), .Q(inst322_q));  // open: PRN
  DFF inst314 (.CLK(undriven_45), .D(inst303_q), .Q(inst314_q));  // open: CLRN, PRN
  DFF inst323 (.CLK(undriven_45), .D(inst304_q), .Q(inst323_q));  // open: CLRN, PRN
  DFF inst309 (.CLK(undriven_45), .D(inst305_q), .Q(inst309_q));  // open: CLRN, PRN
  DFF inst310 (.CLK(undriven_45), .D(inst306_q), .Q(inst310_q));  // open: CLRN, PRN
  DFF inst311 (.CLK(undriven_45), .D(inst307_q), .Q(inst311_q));  // open: CLRN, PRN
  DFF inst312 (.CLK(undriven_45), .D(inst308_q), .Q(inst312_q));  // open: CLRN, PRN
  DFF inst313 (.CLRN(Clock), .CLK(undriven_45), .D(inst322_q), .Q(inst313_q));  // open: PRN
  DFF inst319 (.CLK(undriven_46), .D(inst314_q), .Q(inst319_q));  // open: CLRN, PRN
  DFF inst324 (.CLK(undriven_46), .D(inst323_q), .Q(inst324_q));  // open: CLRN, PRN
  DFF inst315 (.CLK(undriven_46), .D(inst309_q), .Q(inst315_q));  // open: CLRN, PRN
  DFF inst316 (.CLK(undriven_46), .D(inst310_q), .Q(inst316_q));  // open: CLRN, PRN
  DFF inst317 (.CLK(undriven_46), .D(inst311_q), .Q(inst317_q));  // open: CLRN, PRN
  DFF inst320 (.CLK(undriven_46), .D(inst312_q), .Q(inst320_q));  // open: CLRN, PRN
  DFF inst318 (.CLRN(Clock), .CLK(undriven_46), .D(inst313_q), .Q(inst318_q));  // open: PRN
  DFF inst327 (.CLK(undriven_47), .D(inst319_q), .Q(inst327_q));  // open: CLRN, PRN
  DFF inst325 (.CLK(undriven_47), .D(inst324_q), .Q(inst325_q));  // open: CLRN, PRN
  DFF inst330 (.CLK(undriven_47), .D(inst315_q), .Q(inst330_q));  // open: CLRN, PRN
  DFF inst331 (.CLK(undriven_47), .D(inst316_q), .Q(inst331_q));  // open: CLRN, PRN
  DFF inst326 (.CLK(undriven_47), .D(inst317_q), .Q(inst326_q));  // open: CLRN, PRN
  DFF inst332 (.CLK(undriven_47), .D(inst320_q), .Q(inst332_q));  // open: CLRN, PRN
  DFF inst343 (.CLRN(Clock), .CLK(undriven_47), .D(inst318_q), .Q(inst343_q));  // open: PRN
  DFF inst336 (.CLK(undriven_48), .D(inst327_q), .Q(inst336_q));  // open: CLRN, PRN
  DFF inst335 (.CLK(undriven_48), .D(inst325_q), .Q(inst335_q));  // open: CLRN, PRN
  DFF inst334 (.CLK(undriven_48), .D(inst330_q), .Q(inst334_q));  // open: CLRN, PRN
  DFF inst329 (.CLK(undriven_48), .D(inst331_q), .Q(inst329_q));  // open: CLRN, PRN
  DFF inst328 (.CLK(undriven_48), .D(inst326_q), .Q(inst328_q));  // open: CLRN, PRN
  DFF inst333 (.CLK(undriven_48), .D(inst332_q), .Q(inst333_q));  // open: CLRN, PRN
  DFF inst344 (.CLRN(Clock), .CLK(undriven_48), .D(inst343_q), .Q(inst344_q));  // open: PRN
  DFF inst337 (.CLK(undriven_49), .D(inst336_q), .Q(inst337_q));  // open: CLRN, PRN
  DFF inst338 (.CLK(undriven_49), .D(inst335_q), .Q(inst338_q));  // open: CLRN, PRN
  DFF inst339 (.CLK(undriven_49), .D(inst334_q), .Q(inst339_q));  // open: CLRN, PRN
  DFF inst340 (.CLK(undriven_49), .D(inst329_q), .Q(inst340_q));  // open: CLRN, PRN
  DFF inst341 (.CLK(undriven_49), .D(inst328_q), .Q(inst341_q));  // open: CLRN, PRN
  DFF inst342 (.CLK(undriven_49), .D(inst333_q), .Q(inst342_q));  // open: CLRN, PRN
  DFF inst345 (.CLRN(Clock), .CLK(undriven_49), .D(inst344_q), .Q(inst345_q));  // open: PRN
  DFF inst351 (.CLK(undriven_51), .D(inst337_q), .Q(inst351_q));  // open: CLRN, PRN
  DFF inst350 (.CLK(undriven_51), .D(inst338_q), .Q(inst350_q));  // open: CLRN, PRN
  DFF inst349 (.CLK(undriven_51), .D(inst339_q), .Q(inst349_q));  // open: CLRN, PRN
  DFF inst347 (.CLK(undriven_51), .D(inst340_q), .Q(inst347_q));  // open: CLRN, PRN
  DFF inst346 (.CLK(undriven_51), .D(inst341_q), .Q(inst346_q));  // open: CLRN, PRN
  DFF inst348 (.CLK(undriven_51), .D(inst342_q), .Q(inst348_q));  // open: CLRN, PRN
  DFF inst370 (.CLRN(Clock), .CLK(undriven_51), .D(inst345_q), .Q(inst370_q));  // open: PRN
  DFF inst352 (.CLK(undriven_50), .D(inst351_q), .Q(inst352_q));  // open: CLRN, PRN
  DFF inst353 (.CLK(undriven_50), .D(inst350_q), .Q(inst353_q));  // open: CLRN, PRN
  DFF inst354 (.CLK(undriven_50), .D(inst349_q), .Q(inst354_q));  // open: CLRN, PRN
  DFF inst355 (.CLK(undriven_50), .D(inst347_q), .Q(inst355_q));  // open: CLRN, PRN
  DFF inst356 (.CLK(undriven_50), .D(inst346_q), .Q(inst356_q));  // open: CLRN, PRN
  DFF inst357 (.CLK(undriven_50), .D(inst348_q), .Q(inst357_q));  // open: CLRN, PRN
  DFF inst371 (.CLRN(Clock), .CLK(undriven_50), .D(inst370_q), .Q(inst371_q));  // open: PRN
  DFF inst363 (.CLK(undriven_52), .D(inst352_q), .Q(inst363_q));  // open: CLRN, PRN
  DFF inst372 (.CLK(undriven_52), .D(inst353_q), .Q(inst372_q));  // open: CLRN, PRN
  DFF inst358 (.CLK(undriven_52), .D(inst354_q), .Q(inst358_q));  // open: CLRN, PRN
  DFF inst359 (.CLK(undriven_52), .D(inst355_q), .Q(inst359_q));  // open: CLRN, PRN
  DFF inst360 (.CLK(undriven_52), .D(inst356_q), .Q(inst360_q));  // open: CLRN, PRN
  DFF inst361 (.CLK(undriven_52), .D(inst357_q), .Q(inst361_q));  // open: CLRN, PRN
  DFF inst362 (.CLRN(Clock), .CLK(undriven_52), .D(inst371_q), .Q(inst362_q));  // open: PRN
  DFF inst368 (.CLK(undriven_53), .D(inst363_q), .Q(inst368_q));  // open: CLRN, PRN
  DFF inst373 (.CLK(undriven_53), .D(inst372_q), .Q(inst373_q));  // open: CLRN, PRN
  DFF inst364 (.CLK(undriven_53), .D(inst358_q), .Q(inst364_q));  // open: CLRN, PRN
  DFF inst365 (.CLK(undriven_53), .D(inst359_q), .Q(inst365_q));  // open: CLRN, PRN
  DFF inst366 (.CLK(undriven_53), .D(inst360_q), .Q(inst366_q));  // open: CLRN, PRN
  DFF inst369 (.CLK(undriven_53), .D(inst361_q), .Q(inst369_q));  // open: CLRN, PRN
  DFF inst367 (.CLRN(Clock), .CLK(undriven_53), .D(inst362_q), .Q(inst367_q));  // open: PRN
  DFF inst376 (.CLK(undriven_54), .D(inst368_q), .Q(inst376_q));  // open: CLRN, PRN
  DFF inst374 (.CLK(undriven_54), .D(inst373_q), .Q(inst374_q));  // open: CLRN, PRN
  DFF inst379 (.CLK(undriven_54), .D(inst364_q), .Q(inst379_q));  // open: CLRN, PRN
  DFF inst380 (.CLK(undriven_54), .D(inst365_q), .Q(inst380_q));  // open: CLRN, PRN
  DFF inst375 (.CLK(undriven_54), .D(inst366_q), .Q(inst375_q));  // open: CLRN, PRN
  DFF inst381 (.CLK(undriven_54), .D(inst369_q), .Q(inst381_q));  // open: CLRN, PRN
  DFF inst392 (.CLRN(Clock), .CLK(undriven_54), .D(inst367_q), .Q(inst392_q));  // open: PRN
  DFF inst385 (.CLK(undriven_55), .D(inst376_q), .Q(inst385_q));  // open: CLRN, PRN
  DFF inst384 (.CLK(undriven_55), .D(inst374_q), .Q(inst384_q));  // open: CLRN, PRN
  DFF inst383 (.CLK(undriven_55), .D(inst379_q), .Q(inst383_q));  // open: CLRN, PRN
  DFF inst378 (.CLK(undriven_55), .D(inst380_q), .Q(inst378_q));  // open: CLRN, PRN
  DFF inst377 (.CLK(undriven_55), .D(inst375_q), .Q(inst377_q));  // open: CLRN, PRN
  DFF inst382 (.CLK(undriven_55), .D(inst381_q), .Q(inst382_q));  // open: CLRN, PRN
  DFF inst393 (.CLRN(Clock), .CLK(undriven_55), .D(inst392_q), .Q(inst393_q));  // open: PRN
  DFF inst386 (.CLK(undriven_56), .D(inst385_q), .Q(inst386_q));  // open: CLRN, PRN
  DFF inst387 (.CLK(undriven_56), .D(inst384_q), .Q(inst387_q));  // open: CLRN, PRN
  DFF inst388 (.CLK(undriven_56), .D(inst383_q), .Q(inst388_q));  // open: CLRN, PRN
  DFF inst389 (.CLK(undriven_56), .D(inst378_q), .Q(inst389_q));  // open: CLRN, PRN
  DFF inst390 (.CLK(undriven_56), .D(inst377_q), .Q(inst390_q));  // open: CLRN, PRN
  DFF inst391 (.CLK(undriven_56), .D(inst382_q), .Q(inst391_q));  // open: CLRN, PRN
  DFF inst394 (.CLRN(Clock), .CLK(undriven_56), .D(inst393_q), .Q(inst394_q));  // open: PRN
  DFF inst400 (.CLK(undriven_58), .D(inst386_q), .Q(inst400_q));  // open: CLRN, PRN
  DFF inst399 (.CLK(undriven_58), .D(inst387_q), .Q(inst399_q));  // open: CLRN, PRN
  DFF inst398 (.CLK(undriven_58), .D(inst388_q), .Q(inst398_q));  // open: CLRN, PRN
  DFF inst396 (.CLK(undriven_58), .D(inst389_q), .Q(inst396_q));  // open: CLRN, PRN
  DFF inst395 (.CLK(undriven_58), .D(inst390_q), .Q(inst395_q));  // open: CLRN, PRN
  DFF inst397 (.CLK(undriven_58), .D(inst391_q), .Q(inst397_q));  // open: CLRN, PRN
  DFF inst419 (.CLRN(Clock), .CLK(undriven_58), .D(inst394_q), .Q(inst419_q));  // open: PRN
  DFF inst401 (.CLK(undriven_57), .D(inst400_q), .Q(inst401_q));  // open: CLRN, PRN
  DFF inst402 (.CLK(undriven_57), .D(inst399_q), .Q(inst402_q));  // open: CLRN, PRN
  DFF inst403 (.CLK(undriven_57), .D(inst398_q), .Q(inst403_q));  // open: CLRN, PRN
  DFF inst404 (.CLK(undriven_57), .D(inst396_q), .Q(inst404_q));  // open: CLRN, PRN
  DFF inst405 (.CLK(undriven_57), .D(inst395_q), .Q(inst405_q));  // open: CLRN, PRN
  DFF inst406 (.CLK(undriven_57), .D(inst397_q), .Q(inst406_q));  // open: CLRN, PRN
  DFF inst420 (.CLRN(Clock), .CLK(undriven_57), .D(inst419_q), .Q(inst420_q));  // open: PRN
  DFF inst412 (.CLK(undriven_59), .D(inst401_q), .Q(inst412_q));  // open: CLRN, PRN
  DFF inst421 (.CLK(undriven_59), .D(inst402_q), .Q(inst421_q));  // open: CLRN, PRN
  DFF inst407 (.CLK(undriven_59), .D(inst403_q), .Q(inst407_q));  // open: CLRN, PRN
  DFF inst408 (.CLK(undriven_59), .D(inst404_q), .Q(inst408_q));  // open: CLRN, PRN
  DFF inst409 (.CLK(undriven_59), .D(inst405_q), .Q(inst409_q));  // open: CLRN, PRN
  DFF inst410 (.CLK(undriven_59), .D(inst406_q), .Q(inst410_q));  // open: CLRN, PRN
  DFF inst411 (.CLRN(Clock), .CLK(undriven_59), .D(inst420_q), .Q(inst411_q));  // open: PRN
  DFF inst417 (.CLK(undriven_60), .D(inst412_q), .Q(inst417_q));  // open: CLRN, PRN
  DFF inst422 (.CLK(undriven_60), .D(inst421_q), .Q(inst422_q));  // open: CLRN, PRN
  DFF inst413 (.CLK(undriven_60), .D(inst407_q), .Q(inst413_q));  // open: CLRN, PRN
  DFF inst414 (.CLK(undriven_60), .D(inst408_q), .Q(inst414_q));  // open: CLRN, PRN
  DFF inst415 (.CLK(undriven_60), .D(inst409_q), .Q(inst415_q));  // open: CLRN, PRN
  DFF inst418 (.CLK(undriven_60), .D(inst410_q), .Q(inst418_q));  // open: CLRN, PRN
  DFF inst416 (.CLRN(Clock), .CLK(undriven_60), .D(inst411_q), .Q(inst416_q));  // open: PRN
  DFF inst425 (.CLK(undriven_61), .D(inst417_q), .Q(inst425_q));  // open: CLRN, PRN
  DFF inst423 (.CLK(undriven_61), .D(inst422_q), .Q(inst423_q));  // open: CLRN, PRN
  DFF inst428 (.CLK(undriven_61), .D(inst413_q), .Q(inst428_q));  // open: CLRN, PRN
  DFF inst429 (.CLK(undriven_61), .D(inst414_q), .Q(inst429_q));  // open: CLRN, PRN
  DFF inst424 (.CLK(undriven_61), .D(inst415_q), .Q(inst424_q));  // open: CLRN, PRN
  DFF inst430 (.CLK(undriven_61), .D(inst418_q), .Q(inst430_q));  // open: CLRN, PRN
  DFF inst441 (.CLRN(Clock), .CLK(undriven_61), .D(inst416_q), .Q(inst441_q));  // open: PRN
  DFF inst434 (.CLK(undriven_62), .D(inst425_q), .Q(inst434_q));  // open: CLRN, PRN
  DFF inst433 (.CLK(undriven_62), .D(inst423_q), .Q(inst433_q));  // open: CLRN, PRN
  DFF inst432 (.CLK(undriven_62), .D(inst428_q), .Q(inst432_q));  // open: CLRN, PRN
  DFF inst427 (.CLK(undriven_62), .D(inst429_q), .Q(inst427_q));  // open: CLRN, PRN
  DFF inst426 (.CLK(undriven_62), .D(inst424_q), .Q(inst426_q));  // open: CLRN, PRN
  DFF inst431 (.CLK(undriven_62), .D(inst430_q), .Q(inst431_q));  // open: CLRN, PRN
  DFF inst442 (.CLRN(Clock), .CLK(undriven_62), .D(inst441_q), .Q(inst442_q));  // open: PRN
  DFF inst435 (.CLK(undriven_63), .D(inst434_q), .Q(inst435_q));  // open: CLRN, PRN
  DFF inst436 (.CLK(undriven_63), .D(inst433_q), .Q(inst436_q));  // open: CLRN, PRN
  DFF inst437 (.CLK(undriven_63), .D(inst432_q), .Q(inst437_q));  // open: CLRN, PRN
  DFF inst438 (.CLK(undriven_63), .D(inst427_q), .Q(inst438_q));  // open: CLRN, PRN
  DFF inst439 (.CLK(undriven_63), .D(inst426_q), .Q(inst439_q));  // open: CLRN, PRN
  DFF inst440 (.CLK(undriven_63), .D(inst431_q), .Q(inst440_q));  // open: CLRN, PRN
  DFF inst443 (.CLRN(Clock), .CLK(undriven_63), .D(inst442_q), .Q(inst443_q));  // open: PRN
  DFF inst449 (.CLK(Clock), .D(inst435_q), .Q(S1));  // open: CLRN, PRN
  DFF inst448 (.CLK(Clock), .D(inst436_q), .Q(S2));  // open: CLRN, PRN
  DFF inst447 (.CLK(Clock), .D(inst437_q), .Q(S3));  // open: CLRN, PRN
  DFF inst445 (.CLK(Clock), .D(inst438_q), .Q(S4));  // open: CLRN, PRN
  DFF inst444 (.CLK(Clock), .D(inst439_q), .Q(S5));  // open: CLRN, PRN
  DFF inst446 (.CLK(Clock), .D(inst440_q), .Q(S6));  // open: CLRN, PRN
  DFF inst468 (.CLK(Clock), .D(inst443_q), .Q(S7));  // open: CLRN, PRN
endmodule
